# EAGLE schematic smart-timed-plug (EAGLE 7.5.0)
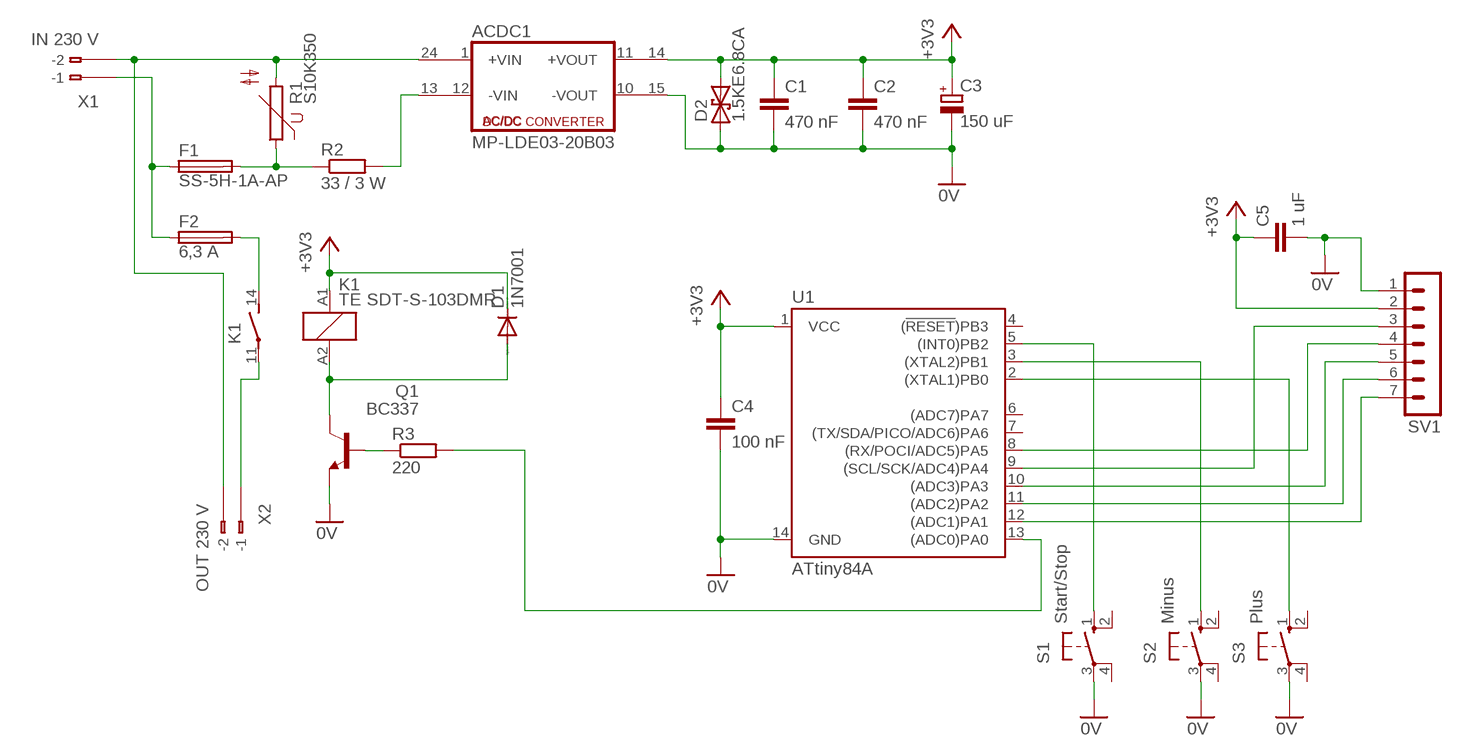
[diagram p0: schematic, sheet 1]

## Parts
ACDC1  MP-LDE03-20B03  DC213R  [CMK]
C1  470 nF  C-EU025-050X050  [C025-050X050]
C2  470 nF  C-EU025-050X050  [C025-050X050]
C3  150 uF  CPOL-EUE2.5-5  [E2,5-5]
C4  100 nF  C-EU025-050X050  [C025-050X050]
C5  1 uF  C-EU025-050X050  [C025-050X050]
D1  1N7001  1N5624  [DO201-15]
D2  1.5KE6.8CA  BZW04XXB  [F126Z12]
F1  SS-5H-1A-AP  GSH15  [GSH15]
F2  6,3 A  GSH15  [GSH15]
K1  TE SDT-S-103DMR  RP431012  [RT-N/O12A5]
Q1  BC337  [TO92]
R1  S10K350  S10K320  [S10K320]
R2  33 / 3 W  R-EU_0207/10  [0207/10]
R3  220  R-EU_0207/10  [0207/10]
S1  Start/Stop  10-XX  [B3F-10XX]
S2  Minus  10-XX  [B3F-10XX]
S3  Plus  10-XX  [B3F-10XX]
SV1  MA07-1  [MA07-1]
U1  ATtiny84A  ATTINY84ATTINY84-20PU  [DIP14]
X1  IN 230 V  233-102  [233-102]
X2  OUT 230 V  233-102  [233-102]

## Nets
0V: ACDC1.15(-VOUT1) C1.2 C2.2 C3.- C4.2 C5.2 D2.A Q1.1(E) S1.3(P) S2.3(P) S3.3(P) SV1.1 U1.14(GND)
+3V3: ACDC1.14(+VOUT1) C1.1 C2.1 C3.+ C4.1 C5.1 D1.C D2.C K1.A1 SV1.2 U1.1(VCC)
N$1: ACDC1.13(-VIN1) R2.2
N$2: ACDC1.24(+VIN1) R1.2 X1.B2(B-2) X2.B2(B-2)
N$3: F1.2 R1.1 R2.1
N$4: F1.1 F2.1 X1.B1(B-1)
N$5: F2.2 K1.14(2:S)
N$6: K1.11(2:P) X2.B1(B-1)
N$7: D1.A K1.A2 Q1.3(C)
N$8: Q1.2(B) R3.1
N$9: R3.2 U1.13((ADC0)PA0)
N$10: S1.1(S) U1.5((INT0)PB2)
N$11: S2.1(S) U1.3((XTAL2)PB1)
N$12: S3.1(S) U1.2((XTAL1)PB0)
N$13: SV1.7 U1.12((ADC1)PA1)
N$14: SV1.6 U1.11((ADC2)PA2)
N$15: SV1.5 U1.10((ADC3)PA3)
N$16: SV1.4 U1.8((RX/POCI/ADC5)PA5)
N$17: SV1.3 U1.9((SCL/SCK/ADC4)PA4)
Unconnected: ACDC1.1(+VIN) ACDC1.10(-VOUT) ACDC1.11(+VOUT) ACDC1.12(-VIN) S1.2(S1) S1.4(P1) S2.2(S1) S2.4(P1) S3.2(S1) S3.4(P1) U1.4((!RESET!)PB3) U1.6((ADC7)PA7) U1.7((TX/SDA/PICO/ADC6)PA6) X1.A1(-1) X1.A2(-2) X2.A1(-1) X2.A2(-2)

## Notes on the sheet
- AC/DC

## Library data of the parts
ACDC1 = dc-dc-converter:DC213R: DC-DC CONVERTER; OC_FARNELL: unknown; OC_NEWARK: unknown
C1 C2 C4 C5 = resistor:C-EU: CAPACITOR, European symbol
C3 = resistor:CPOL-EU: POLARIZED CAPACITOR, European symbol
D1 = diode:1N5624: DIODE controlled avalanche rectifier
D2 = diode:BZW04XXB: DIODE uni and bidirectional supressor diode
F1 F2 = fuse:GSH15: FUSE HOLDER grid 15mm, 19649 Wickmann; MPN: 64900001039; OC_FARNELL: 1271673; OC_NEWARK: 02P0318
K1 = relay:RP?31*: Power PCB Relay RP II/1 SCHRACK 1 pole 8 / 12 A Source: http://www.schrack.com/.. 5834.pdf; MF: TYCO ELECTRONICS; MPN: 4-1393231-5; OC_FARNELL: unknown; OC_NEWARK: 13H3096
Q1 = transistor-npn:BC337*: NPN Transistor
R1 = varistor:S10K320: VARISTOR
R2 R3 = resistor:R-EU_: RESISTOR, European symbol
S1-S3 = switch-omron:10-XX: OMRON SWITCH; MPN: B3F-1000; OC_FARNELL: 176432; OC_NEWARK: 36M3542
SV1 = con-lstb:MA07-1: PIN HEADER; OC_FARNELL: unknown; OC_NEWARK: unknown
U1 = SparkFun-IC-Microcontroller:ATTINY84: Atmel 14-pin 2/4/8kB flash uC Datasheet <https://cdn.sparkfun.com/datasheets/Widgets/doc8006.pdf> SparkFun Products Tiny AVR Programmer <https://www.sparkfun.com/products/11801> (PGM-11801) SparkFun Servo Trigger - Continuous Rotation <https://www.sparkfun.com/products/13872> (WIG-13872) SparkFun Servo Trigger <https://www.sparkfun.com/products/13118> (WIG-13118)
X1 X2 = con-wago:233-102: WAGO Cage Clamp; MPN: 233-102; OC_FARNELL: unknown; OC_NEWARK: 28K9044